# Altium schematic sheet 06_MCU.SchDoc
size 431 x 279 mm; SheetNumber: 8; SheetTotal: 9; ENG_APP_DATE: --/--/--; DSN_APP_DATE: --/--/--; CHK_APP_DATE: --/--/--
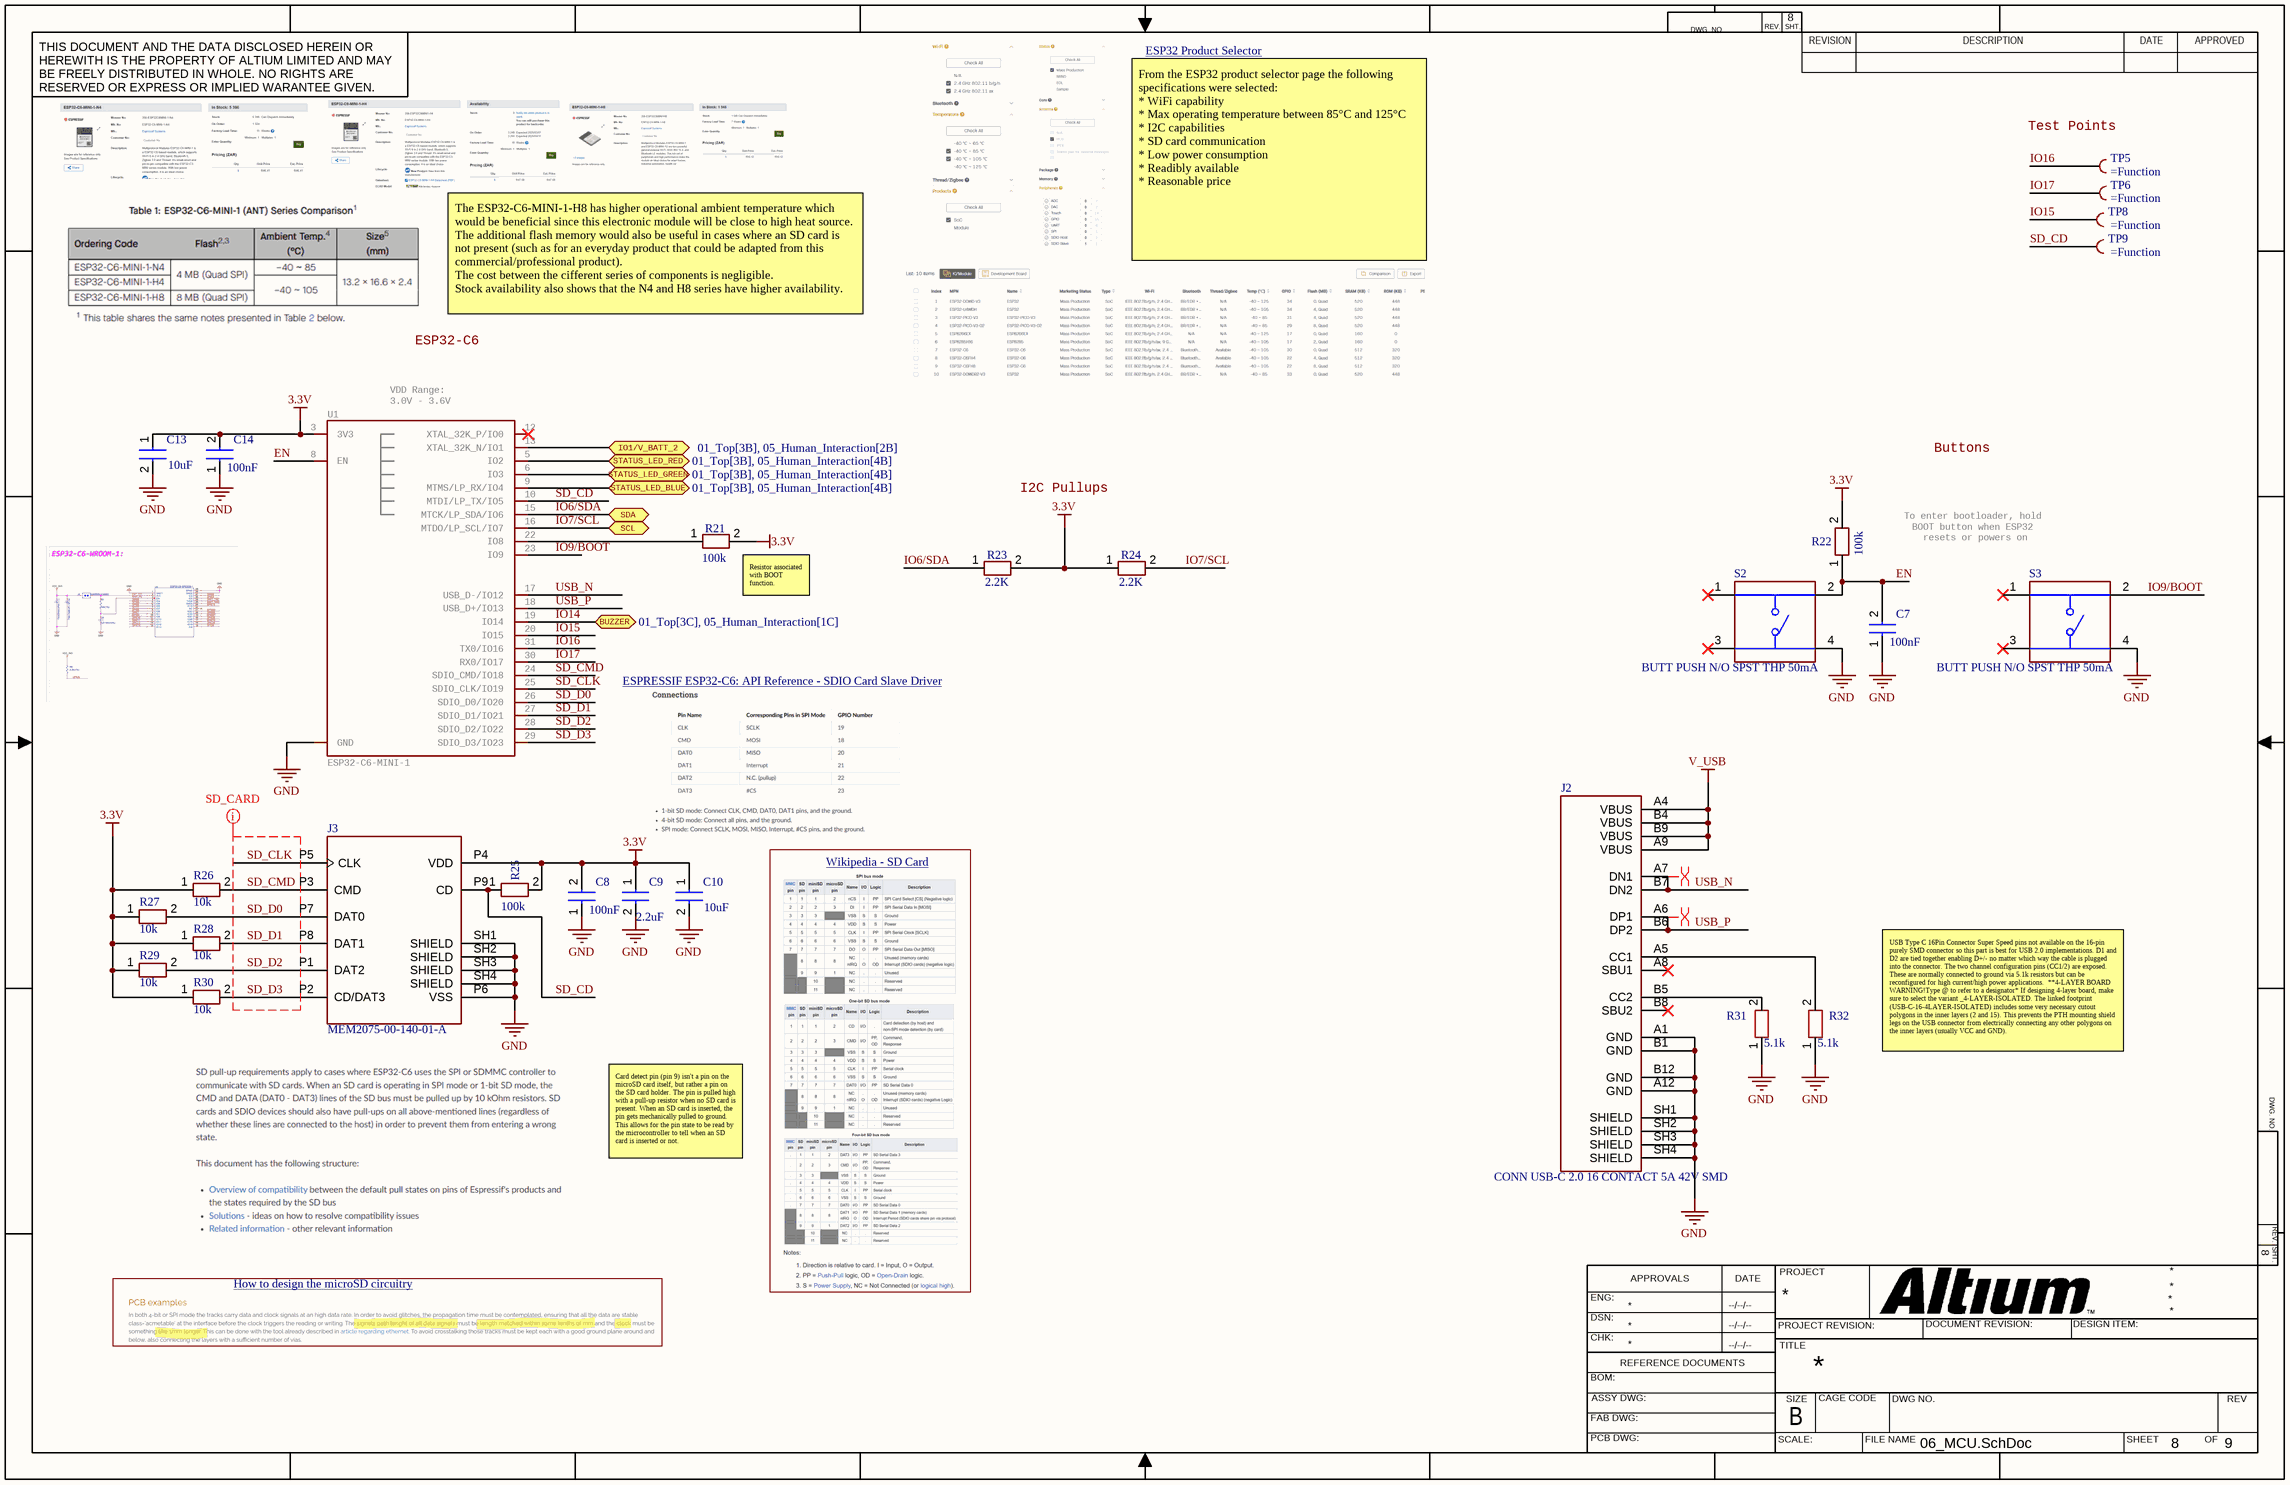
[diagram p0: 06_MCU.SchDoc]

## Parts
C7  100nF  [CAPC2012X94N]
C8  100nF  [CAPC2012X94N]
C9  2.2uF  [CAPC2012X135N]
C10  10uF  [CAPC2012X94N]
C13  10uF  [CAPC2012X94N]
C14  100nF  [CAPC2012X94N]
J2  CONN USB-C 2.0 16 CONTACT 5A 42V SMD  [CUI_UJ20-C-H-G-SMT-TR]
J3  MEM2075-00-140-01-A  [GCT_MEM2075-00-140-01-A]
R21  100k  [RESC2012X50N]
R22  100k  [RESC2012X50N]
R23  2.2K  [RESC2012X70N]
R24  2.2K  [RESC2012X70N]
R25  100k  [RESC2012X50N]
R26  10k  [RESC2012X60N]
R27  10k  [RESC2012X60N]
R28  10k  [RESC2012X60N]
R29  10k  [RESC2012X60N]
R30  10k  [RESC2012X60N]
R31  5.1k  [RESC2012X60N]
R32  5.1k  [RESC2012X60N]
S2  BUTT PUSH N/O SPST THP 50mA  [SW_TS02-66-43-BK-100-LCR-D]
S3  BUTT PUSH N/O SPST THP 50mA  [SW_TS02-66-43-BK-100-LCR-D]
TP5  (no value)  [TP_Pad_TH_1.2P_0.6H]  (no BOM)
TP6  (no value)  [TP_Pad_TH_1.2P_0.6H]  (no BOM)
TP8  (no value)  [TP_Pad_TH_1.2P_0.6H]  (no BOM)
TP9  (no value)  [TP_Pad_TH_1.2P_0.6H]  (no BOM)
U1  ESP32-C6-MINI-1  [ESP32C6MINI1H8]

## Ports
BUZZER (bidir, see 01_Top[3C], 05_Human_Interaction[1C]), IO1/V_BATT_2 (bidir, see 01_Top[3B], 05_Human_Interaction[2B]), SCL (bidir, see 01_Top[2C], 03_Temp_Sensor[4B], 04.2_Thermocouple_Handling_01[2B], 04_Accelerometer[3B]), SDA (bidir, see 01_Top[2C], 03_Temp_Sensor[4B], 04.2_Thermocouple_Handling_01[2B], 04_Accelerometer[3C]), STATUS_LED_BLUE (bidir, see 01_Top[3B], 05_Human_Interaction[4B]), STATUS_LED_GREEN (bidir, see 01_Top[3B], 05_Human_Interaction[4B]), STATUS_LED_RED (bidir, see 01_Top[3B], 05_Human_Interaction[4B])

## Nets
3.3V: C8.2 C9.1 C10.1 C13.1 C14.2 J3.P4(VDD) R21.2 R22.2 R23.2 R24.1 R25.2 R26.1 R27.1 R28.1 R29.1 R30.1 U1.3(3V3)
GND: C7.1 C8.1 C9.2 C10.2 C13.2 C14.1 J2.A1(GND) J2.A12(GND) J2.B1(GND) J2.B12(GND) J2.SH1(SHIELD) J2.SH2(SHIELD) J2.SH3(SHIELD) J2.SH4(SHIELD) J3.P6(VSS) J3.SH1(SHIELD) J3.SH2(SHIELD) J3.SH3(SHIELD) J3.SH4(SHIELD) R31.1 R32.1 S2.4 S3.4 U1.1(GND)
V_USB: J2.A4(VBUS) J2.A9(VBUS) J2.B4(VBUS) J2.B9(VBUS)
EN: C7.2 R22.1 S2.2 U1.8(EN)
IO1/V_BATT_2: U1.13(XTAL_32K_N/IO1) ; port IO1/V_BATT_2
IO6/SDA: R23.1 U1.15(MTCK/LP_SDA/IO6) ; port SDA
IO7/SCL: R24.2 U1.16(MTDO/LP_SCL/IO7) ; port SCL
IO9/BOOT: S3.2 U1.23(IO9)
IO14: U1.19(IO14) ; port BUZZER
IO15: TP8.TP U1.20(IO15)
IO16: TP5.TP U1.31(TX0/IO16)
IO17: TP6.TP U1.30(RX0/IO17)
SD_CD: J3.P9(CD) R25.1 TP9.TP U1.10(MTDI/LP_TX/IO5)
SD_CLK: J3.P5(CLK) U1.25(SDIO_CLK/IO19)
SD_CMD: J3.P3(CMD) R26.2 U1.24(SDIO_CMD/IO18)
SD_D0: J3.P7(DAT0) R27.2 U1.26(SDIO_D0/IO20)
SD_D1: J3.P8(DAT1) R28.2 U1.27(SDIO_D1/IO21)
SD_D2: J3.P1(DAT2) R29.2 U1.28(SDIO_D2/IO22)
SD_D3: J3.P2(CD/DAT3) R30.2 U1.29(SDIO_D3/IO23)
STATUS_LED_BLUE: U1.9(MTMS/LP_RX/IO4) ; port STATUS_LED_BLUE
STATUS_LED_GREEN: U1.6(IO3) ; port STATUS_LED_GREEN
STATUS_LED_RED: U1.5(IO2) ; port STATUS_LED_RED
USB_N: J2.A7(DN1) J2.B7(DN2) U1.17(USB_D-/IO12)
USB_P: J2.A6(DP1) J2.B6(DP2) U1.18(USB_D+/IO13)
NetJ2_A5: J2.A5(CC1) R32.2
NetJ2_B5: J2.B5(CC2) R31.2
NetR21_1: R21.1 U1.22(IO8)

Not connected (* = marked no-connect by the designer): J2 A8(SBU1)* B8(SBU2)*; S2 1* 3*; S3 1* 3*; U1 12(XTAL_32K_P/IO0)*

## Layout directives
differential pair: USB_N, USB_P
net class SD Card: SD_CLK, SD_CMD, SD_D0, SD_D1, SD_D2, SD_D3

## Notes on the sheet
- ESP32 Product Selector <https://products.espressif.com/#/product-selector?names=>
- (near TP5) Test Points
- From the ESP32 product selector page the following specifications were selected:
  * WiFi capability
  * Max operating temperature between 85°C and 125°C
  * I2C capabilities
  * SD card communication
  * Low power consumption
  * Readibly available
  * Reasonable price
- ESP32-C6
- The ESP32-C6-MINI-1-H8 has higher operational ambient temperature which would be beneficial since this electronic module will be close to high heat source. The additional flash memory would also be useful in cases where an SD card is not present (such as for an everyday product that could be adapted from this commercial/professional product).
  The cost between the cifferent series of components is negligible.
  Stock availability also shows that the N4 and H8 series have higher availability.
- (near U1) VDD Range:
  3.0V - 3.6V
- I2C Pullups
- Buttons
- To enter bootloader, hold
  BOOT button when ESP32
  resets or powers on
- (near R21) Resistor associated with BOOT function.
- ESPRESSIF ESP32-C6: API Reference - SDIO Card Slave Driver <https://docs.espressif.com/projects/esp-idf/en/v5.2.4/esp32c6/api-reference/peripherals/sdio_slave.html>
- Wikipedia - SD Card <https://en.wikipedia.org/wiki/SD_card#Technical_details>
- USB Type C 16Pin Connector Super Speed pins not available on the 16-pin purely SMD connector so this part is best for USB 2.0 implementations. D1 and D2 are tied together enabling D+/- no matter which way the cable is plugged into the connector. The two channel configuration pins (CC1/2) are exposed. These are normally connected to ground via 5.1k resistors but can be reconfigured for high current/high power applications.  **4-LAYER BOARD WARNING!Type @ to refer to a designator* If designing 4-layer board, make sure to select the variant _4-LAYER-ISOLATED. The linked footprint (USB-C-16-4LAYER-ISOLATED) includes some very necessary cutout polygons in the inner layers (2 and 15). This prevents the PTH mounting shield legs on the USB connector from electrically connecting any other polygons on the inner layers (usually VCC and GND).
- Card detect pin (pin 9) isn't a pin on the microSD card itself, but rather a pin on the SD card holder. The pin is pulled high with a pull-up resistor when no SD card is present. When an SD card is inserted, the pin gets mechanically pulled to ground. This allows for the pin state to be read by the microcontroller to tell when an SD card is inserted or not.
- How to design the microSD circuitry <https://www.acmesystems.it/pcb_microsd>
- DWG. NO.
- REV.
- SHT.
- THIS DOCUMENT AND THE DATA DISCLOSED HEREIN OR HEREWITH IS THE PROPERTY OF ALTIUM LIMITED AND MAY BE FREELY DISTRIBUTED IN WHOLE. NO RIGHTS ARE RESERVED OR EXPRESS OR IMPLIED WARANTEE GIVEN.
- REVISION
- DESCRIPTION
- DATE
- APPROVED
- ENG:
- APPROVALS
- PROJECT
- DSN:
- CHK:
- REFERENCE DOCUMENTS
- PROJECT REVISION:
- TITLE
- DOCUMENT REVISION:
- DESIGN ITEM:
- BOM:
- FAB DWG:
- PCB DWG:
- ASSY DWG:
- SCALE:
- SIZE
- B
- CAGE CODE
- FILE NAME
- DWG NO.
- SHEET
- OF
- REV

## Library data of the parts
C7 C8 C14 = CAP CER 100nF 0805 SMD: Capacitor; Manufacturer_Part_Number: 08055C104KAZ2A; ComponentLink1Description: Datasheet; ComponentLink1URL: http://datasheets.avx.com/X7RDielectric.pdf
C9 = CAP CER 2u2F 0805 SMD: Capacitor; Manufacturer_Part_Number: LMK212BJ225MG-T
C10 C13 = CAP CER 10uF 0805 SMD: Capacitor; Manufacturer_Part_Number: CL21A106KOQNNNE; ComponentLink1Description: Datasheet; ComponentLink1URL: https://www.mouser.co.za/datasheet/2/585/MLCC-1837944.pdf
J2 = CONN USB-C 2.0 16 CONTACT 5A 42V SMD: USB Connectors Type C,2.0, Horizontal, Gold plated 3u, Mid Surface Mount 1.0mm, 16 pin, T&R; Manufacturer_Part_Number: UJ20-C-H-G-SMT-TR; ComponentLink1Description: Datasheet; ComponentLink1URL: https://www.sameskydevices.com/product/resource/uj20-c-h-g-smt-tr.pdf
J3 = SD CARD SOCKET SMD MEM2075-00-140-01-A: 9 (8 + 1) Position Card Connector microSD Surface Mount, Right Angle Gold; ComponentLink1Description: Datasheet; ComponentLink1URL: https://www.mouser.co.za/datasheet/2/837/MEM2075-2887971.pdf; Manufacturer_Part_Number: MEM2075-00-140-01-A
R21 R22 R25 = RES 100K 0805 SMD: Resistor; Manufacturer_Part_Number: CRCW0805100KJNECC
R23 R24 = RES 2.2K 0805 SMD: Resistor; Manufacturer_Part_Number: ERJ-PB6B2201V
R26-R30 = RES 10K 0805 SMD: Resistor; Manufacturer_Part_Number: CR0805-FX-1002ELF
R31 R32 = RES 5.1K 0805 SMD: Resistor; Manufacturer_Part_Number: RC0805JR-075K1L; ComponentLink1Description: Datasheet; ComponentLink1URL: https://industrial.panasonic.com/cdbs/www-data/pdf/RDA0000/AOA0000C84.pdf
S2 S3 = BUTT PUSH N/O SPST THP 50mA: 6 x 6 mm, 4.3 mm Actuator Height, 100 gf, Black, Long Crimped, Through Hole, SPST, Tactile Switch; Manufacturer_Part_Number: TS02-66-43-BK-100-LCR-D
TP5 TP6 TP8 TP9 = TP 1.5mm PAD
U1 = ESP32-C6-MINI-1: Manufacturer_Part_Number: ESP32-C6-MINI-1-H8; ComponentLink1Description: Datasheet; ComponentLink1URL: https://www.mouser.com/catalog/specsheets/Espressif_Systems_esp32-c6-mini-1_mini-1u_datasheet_en.pdf?_gl=1*7278yr*_gcl_aw*R0NMLjE3Mzk0MzM2MTQuQ2p3S0NBaUFxckc5QmhBVkVpd0FhUHU1emlsTWRuRXdaa2Fsd2VWNEN5MzNjMjVBX1BkRDhocTJZbnRtek0tckw4Q0pVVXJTcmNRbGdob0NCcXNRQXZEX0J3RQ..*_gcl_au*ODgyNzE3NTQxLjE3NDEwOTkzMzU.*_ga*MjEzMDEzNzc2Mi4xNzMzMzA0NDkw*_ga_15W4STQT4T*MTc0MTUxNTkxNS42MC4xLjE3NDE1MTgwNDEuMzcuMC4w